# Altium schematic sheet DOOR.SchDoc
size A4
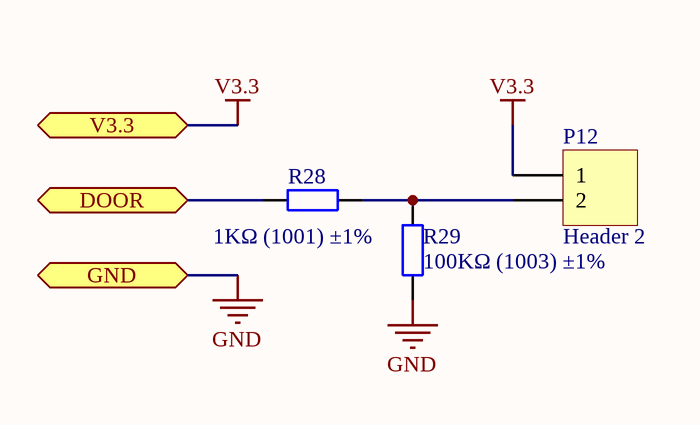
[diagram p0: DOOR.SchDoc]

## Parts
P12  Header 2  [2P_XH2.54]
R28  1KΩ (1001) ±1%  [0805_R]
R29  100KΩ (1003) ±1%  [0805_R]

## Ports
DOOR, GND, V3.3

## Nets
GND: R29.2 ; port GND
V3.3: P12.1 ; port V3.3
DOOR: R28.1 ; port DOOR
NetP12_2: P12.2 R28.2 R29.1

## Library data of the parts
P12 = Header 2: Header, 2-Pin; LatestRevisionDate: 17-Jul-2002; LatestRevisionNote: Re-released for DXP Platform.; Publisher: Altium Limited
R28 = 0805 1KΩ (1001) 1%: 贴片电阻; ComponentLink1Description: 供应商链接; ComponentLink1URL: http://www.szlcsc.com/product/details_18201.html; Package: 0805; Supplier: LC; SuppliersPartNumber: C17513
R29 = 0805 100KΩ (1003) 1%: 贴片电阻; ComponentLink1Description: 供应商链接; ComponentLink1URL: http://www.szlcsc.com/product/details_18095.html; Package: 0805; Supplier: LC; SuppliersPartNumber: C17407